# Altium schematic sheet ADC.SchDoc
size A3
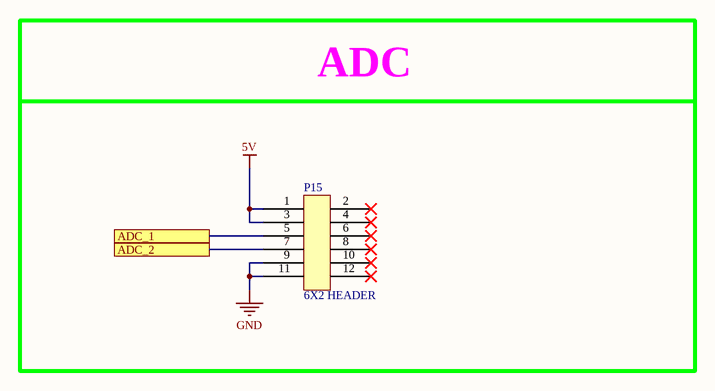
[diagram p0: ADC.SchDoc]

## Parts
P15  CONN HEADER VERT 12POS 2.54MM  [281739-6]  (value not drawn)

## Blocks framed on the sheet
ADC: P15

## Ports
ADC_1, ADC_2

## Nets
5V: P15.1 P15.3
GND: P15.9 P15.11
ADC_1: P15.5 ; port ADC_1
ADC_2: P15.7 ; port ADC_2

Not connected (* = marked no-connect by the designer): P15 2* 4* 6* 8* 10* 12*

## Notes on the sheet
- (in symbol 281739-6) 6X2 HEADER

## Library data of the parts
P15 = 281739-6: Conn Shrouded Header HDR 12 POS 2.54mm Solder ST Thru-Hole Loose Piece; Manufacturer: TE Connectivity; Current Rating: 3A; Number of Poles: 12; Contact Resistance: 15mR; Mating Cycles: 30; Insulation Resistance: 1GR; Working Voltage: 500V; Connector Type: Plug,Header,Pin; Gender: Male; Board Standoff: No (Without); Contact Protection: Yes (With); Keyed: No; PCB Mount Retention: Without; PCB Mounting Orientation: Vertical; Contact Post Length: 2.9mm; Hole Diameter: 1mm; Supplier 1: Digi-Key; Manufacturer Part Number: 281739-6; RoHS: Yes; Category: Headers and Wire Housings; Stock 1: 2109; Pricing 1: 1=2,80000, 10=2,54500, 100=2,24220, 500=1,90586, 1000=1,62559, 5000=1,49479 (USD); Mount: Through Hole; Contact Plating: Tin; Color: Blue; Material: Glass,Polyester; Insulation Material: Thermoplastic; Contact Material: Bronze; Housing Color: Blue; Housing Material: Thermoplastic; Contact Shape: Square; Contact Finish - Mating: TIN; Insulation Color: Blue; Min Operating Temperature: -55°C; Max Operating Temperature: 105°C; Number of Rows: 2; Package Quantity: 2000; Termination: Through Hole; Number of Contacts: 12; Series: HE13/HE14; Packaging: Box; Contact Gender: Male; Number of Positions: 12; Orientation: Straight; Gasket: No (Without); Mating Alignment: No (Without); Mating Connector Lock: No (Without); Selectively Loaded: No (Without); Stabilizers: No (Without); Strain Relief: No (Without); Contact Current Rating: 3A; Fastening Type: Friction; Contact Type: Male Pin; Length: 15.24mm; Pitch: 2.54mm; Lead Pitch: 2.54mm; Row Spacing: 2.54mm; Contact Mating Length: 6.75mm; Depth: 7.62mm; Shrouded End Dimension: 1.27mm; Radiation Hardening: No; REACH SVHC: No SVHC; RoHS Compliant: Yes; Flammability Rating: UL94 V-0; ELV: Compliant; ComponentLink1URL: https://datasheet.ciiva.com/11748/0900766b8124a6f5-11748092.pdf?src-supplier=RSComponents; ComponentLink1Description: https://datasheet.ciiva.com/11748/0900766b8124a6f5-11748092.pdf?src-supplier=RSComponents; ComponentLink2URL: https://datasheet.ciiva.com/41447/001173320-da-01-ml-he14-stiftleiste-0-0281739-6-en-fr-41447806.pdf?src-supplier=Conrad; ComponentLink2Description: https://datasheet.ciiva.com/41447/001173320-da-01-ml-he14-stiftleiste-0-0281739-6-en-fr-41447806.pdf?src-supplier=Conrad; ComponentLink3URL: https://datasheet.ciiva.com/7212/23844-7212941.pdf?src-supplier=Newark; ComponentLink3Description: https://datasheet.ciiva.com/7212/23844-7212941.pdf?src-supplier=Newark; ComponentLink4URL: https://datasheet.ciiva.com/731/eng-cd-281739-g1-731286.pdf?src-supplier=Digi-Key; ComponentLink4Description: https://datasheet.ciiva.com/731/eng-cd-281739-g1-731286.pdf?src-supplier=Digi-Key; Supplier Part Number 1: A121458-ND